# Altium schematic sheet ESP32.SchDoc
size A; SheetNumber: 3; SheetTotal: 5
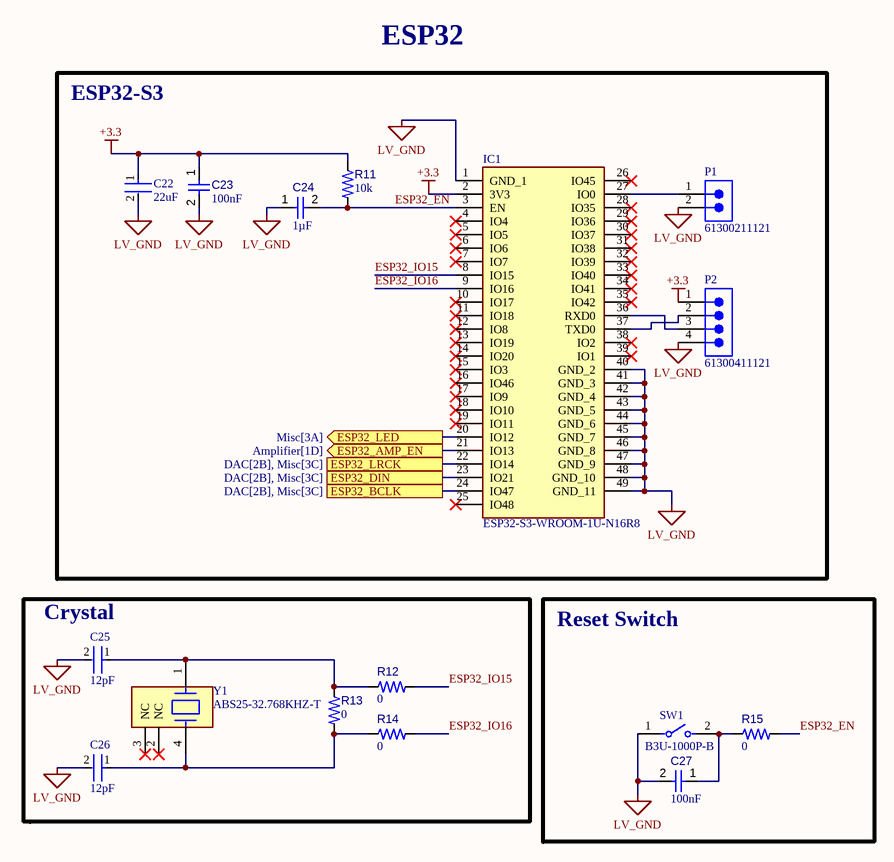
[diagram p0: ESP32.SchDoc]

## Parts
C22  22uF  [FP-GRM188-0_2-IPC_C]
C23  value 100nF  [FP-0603-L_1_6_0_15-W_0_81-IPC_C]  (hidden comment: 06035C104K4T2A)
C24  value 1µF  [CAPC0603(1608)100_L]  (hidden comment: Capacitor 1µF +/-0.1% 25V 0603)
C25  12pF  [FP-C0603C-CF-MFG]
C26  12pF  [FP-C0603C-CF-MFG]
C27  value 100nF  [FP-0603-L_1_6_0_15-W_0_81-IPC_C]  (hidden comment: 06035C104K4T2A)
IC1  ESP32-S3-WROOM-1U-N16R8  [ESP32S3WROOM1UN16R8]
P1  61300211121  [61300211121]
P2  61300411121  [61300411121]
R11  value 10k  [FP-CRCW0603-e3-IPC_C]  (hidden comment: CRCW060310K0JNEA)
R12  value 0  [RESC0603(1608)_L]  (hidden comment: Jumper 0603)
R13  value 0  [RESC0603(1608)_L]  (hidden comment: Jumper 0603)
R14  value 0  [RESC0603(1608)_L]  (hidden comment: Jumper 0603)
R15  value 0  [RESC0603(1608)_L]  (hidden comment: Jumper 0603)
SW1  B3U-1000P-B  [FP-B3U-1000P-B-MFG]
Y1  ABS25-32.768KHZ-T  [FP-ABS25-MFG]

## Blocks framed on the sheet
ESP32-S3: C22-C24 IC1 P1 P2 R11
Crystal: C25 C26 R12-R14 Y1
Reset Switch: C27 R15 SW1

## Ports
ESP32_AMP_EN (out, see Amplifier[1D]), ESP32_BCLK (see DAC[2B], Misc[3C]), ESP32_DIN (see DAC[2B], Misc[3C]), ESP32_LED (out, see Misc[3A]), ESP32_LRCK (see DAC[2B], Misc[3C])

## Nets
+3.3: C22.1 C23.1 IC1.2(3V3) P2.1 R11.1
LV_GND: C22.2 C23.2 C24.1 C25.2 C26.2 C27.2 IC1.1(GND_1) IC1.40(GND_2) IC1.41(GND_3) IC1.42(GND_4) IC1.43(GND_5) IC1.44(GND_6) IC1.45(GND_7) IC1.46(GND_8) IC1.47(GND_9) IC1.48(GND_10) IC1.49(GND_11) P1.2 P2.4 SW1.1
ESP32_AMP_EN: IC1.21(IO13) ; port ESP32_AMP_EN
ESP32_BCLK: IC1.24(IO47) ; port ESP32_BCLK
ESP32_DIN: IC1.23(IO21) ; port ESP32_DIN
ESP32_EN: C24.2 IC1.3(EN) R11.2 R15.2
ESP32_IO15: IC1.8(IO15) R12.2
ESP32_IO16: IC1.9(IO16) R14.2
ESP32_LED: IC1.20(IO12) ; port ESP32_LED
ESP32_LRCK: IC1.22(IO14) ; port ESP32_LRCK
NetC25_1: C25.1 R12.1 R13.1 Y1.1
NetC26_1: C26.1 R13.2 R14.1 Y1.4
NetC27_1: C27.1 R15.1 SW1.2
NetIC1_27: IC1.27(IO0) P1.1
NetIC1_36: IC1.36(RXD0) P2.3
NetIC1_37: IC1.37(TXD0) P2.2

Not connected (* = marked no-connect by the designer): IC1 4(IO4)* 5(IO5)* 6(IO6)* 7(IO7)* 10(IO17)* 11(IO18)* 12(IO8)* 13(IO19)* 14(IO20)* 15(IO3)* 16(IO46)* 17(IO9)* 18(IO10)* 19(IO11)* 25(IO48)* 26(IO45)* 28(IO35)* 29(IO36)* 30(IO37)* 31(IO38)* 32(IO39)* 33(IO40)* 34(IO41)* 35(IO42)* 38(IO2)* 39(IO1)*; Y1 2(NC)* 3(NC)*

## Notes on the sheet
- ESP32

## Library data of the parts
C22 = CMP-2000-06337-3: Chip Multilayer Ceramic Capacitors for General Purpose, 0603, 22uF, X5R, 15%, 20%, 10V; Tolerance: 20%; Weight: 0.000222oz; Material: Ceramic; Depth: 0.8mm; Length: 1.6mm; Termination: SMD/SMT; Capacitance: 22uF; Packaging: Tape and Reel; Width: 0.8mm; Voltage Rating: 10V; Case Code (Imperial): 0603; Mount: Surface Mount; Voltage Rating (DC): 10V; Case/Package: 0603; Thickness: 0.039inch; REACH SVHC: No SVHC; Dielectric: X5R; Height: 0.8mm; Package Quantity: 4000; Case Code (Metric): 1608; Min Operating Temperature: -55°C; Lead Free: Lead Free; Max Operating Temperature: 85°C
C23 C27 = CMP-001-00085-1: Ceramic Capacitor, Multilayer, Ceramic, 50V, 10% +Tol, 10% -Tol, X7R, 15% TC, 0.1uF, Surface Mount, 0603; RoHS Compliant: Yes; Pins: 2; Capacitor Type: Ceramic; Min Operating Temperature: -55°C; Case/Package: 0603; Mounting Technology: Surface Mount; Max Operating Temperature: 125°C
C24 = CMP-001-00055-4: Chip Capacitor, 1µF +/-0.1%, 25V, 0603, Thickness 1 mm; Tolerance: 20%; Min Operating Temperature: -55°C; Max Operating Temperature: 85°C; Voltage Rating: 25V; Mounting Technology: SMT; Case/Package: 0603; Pins: 2
C25 C26 = CMP-2006-03703-3: Ceramic Capacitor 12Pf 50V, C0G, 5%, 0603, Full Reel; Manufacturer: KEMET; Manufacturer Part Number: C0603C120J5GACTU; Automotive Grade: Grade 1; Temperature Coefficient: 30ppm/°C; Tolerance: 0.05; Temperature Range High: +125°C; Temperature Characteristic: C0G; Temperature Range Low: -55°C; Voltage Rating: 50 V; Mouser Description: Ceramic Capacitor 12Pf 50V, C0G, 5%, 0603, Full Reel; Package: C0603C-CF; Temperature: -55°C to +125°C; Device Class L3: Ceramic Capacitors; Value: 12 pF; Material: Ceramic; Lead Free: Yes; ComponentLink2URL: https://api.kemet.com/component-edge/download/datasheet/C0603C100J5GACAUTO.pdf; Category: Cap; Capacitance: 12 pF; ComponentLink2Description: Datasheet; Device Class L1: Passive Components; Height: 0.87mm; Device Class L2: Capacitors; Digikey Description: Ceramic Capacitor 12Pf 50V, C0G, 5%, 0603, Full Reel; RoHS: TRUE; Octopart: https://octopart.com/c0603c120j5gactu-kemet-108780; Automotive: Yes
IC1 = ESP32-S3-WROOM-1U-N16R8: Integrated Circuit; Manufacturer_Name: Espressif Systems; Datasheet Link: https://www.espressif.com/sites/default/files/documentation/esp32-s3-wroom-1_wroom-1u_datasheet_en.pdf; Height: 3.35mm; Manufacturer_Part_Number: ESP32-S3-WROOM-1U-N16R8; Mouser Part Number: 356-ESP32S3WM1UN16R8; Mouser Price/Stock: https://www.mouser.co.uk/ProductDetail/Espressif-Systems/ESP32-S3-WROOM-1U-N16R8?qs=Li%252BoUPsLEns6V0Pr5KRJtw%3D%3D
P1 = CMP-1712-00002-6: NexarPartId: 20081794; Number of Contacts: 2; Pitch: 2.54mm; Connector Type: Male Pin; Voltage Rating: 250V; Current Rating: 3A; Gender: Male; Contact Resistance: 20mΩ; Height: 8.94mm; Lead Free: Lead Free; Number of Pins: 2; Termination: Through Hole; RoHS: Compliant; Lead Pitch: 2.54mm; REACH SVHC: No SVHC; Housing Material: PBT; Contact Mating Length: 5.9944mm; Min Operating Temperature: -40°C; Orientation: Vertical; Contact Material: Copper; Contact Gender: Male; Max Operating Temperature: 125°C; Number of Rows: 1; Number of Positions: 2; Packaging: Bulk; Contact Plating: Gold; Mount: Through Hole; Color: Black; Operating Supply Voltage: 250V
P2 = CMP-1502-01064-3: NexarPartId: 32855522; Operating Supply Voltage: 250V; Pitch: 2.54mm; Contact Resistance: 20mΩ; Number of Positions: 4; Current Rating: 3A; Connector Type: Male Pin; Gender: Male; Contact Plating: Gold; Height: 8.89mm; Lead Pitch: 2.54mm; Lead Free: Lead Free; Contact Mating Length: 5.9944mm; Number of Rows: 1; Termination: Solder; Packaging: Bulk; REACH SVHC: Unknown; Min Operating Temperature: -40°C; RoHS: Compliant; Number of Contacts: 4; Voltage Rating: 250V; Color: Black; Max Operating Temperature: 105°C; Contact Material: Copper; Mount: Through Hole; Orientation: Vertical; Number of Pins: 4
R11 = CMP-009-00197-4: Fixed Resistor, Metal Glaze/thick Film, 0.1W, 10000ohm, 75V, 5% +/-Tol, 200ppm/Cel, Surface Mount, 0603; Power: 100mW; Mounting Technology: Surface Mount; Tolerance: 5%; RoHS Compliant: Yes; Pins: 2; Max Operating Temperature: 155°C; Min Operating Temperature: -55°C; Case/Package: 0603
R12-R15 = CMP-009-00175-6: Pins: 2; Case/Package: 0603; Min Operating Temperature: -55°C; Max Operating Temperature: 155°C
SW1 = CMP-08834-000005-1: SWITCH TACTILE SPST-NO 0.05A 12V; Manufacturer: Omron; Operating Force: 1.5N; Contact Current Rating: 50mA; Contact Resistance: 100mΩ; Electromechanical Life: 200000Cycles; Height: 1.75mm; Device Class L2: Switches; Temperature Range High: +70°C; Digikey Description: SWITCH TACTILE SPST-NO 0.05A 12V; Throw Configuration: SPST-NO; Ambient Temperature Range High: +70°C; Temperature: -25°C to +70°C; Lead Free: Yes; ComponentLink2URL: https://omronfs.omron.com/en_US/ecb/products/pdf/en-b3u.pdf; Device Class L3: Tactile Switches; Manufacturer Part Number: B3U-1000P-B; Ambient Temperature Range Low: -25°C; Mount: Surface Mount; Automotive: No; Mouser Description: Tactile Switches Top Actuated with boss w/o ground; Octopart: https://octopart.com/b3u-1000p-b-omron-1057356; RoHS: TRUE; Package: 0; Device Class L1: Electromechanical; Voltage Rating Dc: 12V; Category: Switch; Temperature Range Low: -25°C; ComponentLink2Description: Datasheet
Y1 = CMP-2000-05037-2: CRYSTAL 32.7680KHZ 12.5PF SMD; ESR (Equivalent Series Resistance): 50kR; Tolerance: 20ppm; Width: 3.8mm; REACH SVHC: No SVHC; Load Capacitance: 12.5pF; Case/Package: SMD/SMT; Radiation Hardening: No; Series: ABS25; Number of Pins: 4; Mount: Surface Mount; RoHS Compliant: Yes; Packaging: Tape and Reel; Termination: SMD/SMT; Frequency Tolerance: 20ppm; Lead Free: Lead Free; Package Quantity: 1000; Min Operating Temperature: -40°C; Height: 0.098inch; Length: 8mm; Frequency: 32.768kHz; Max Operating Temperature: 85°C; Series Resistance: 50kR; Operating Frequency: 32.768 kHz; Depth: 3.8mm